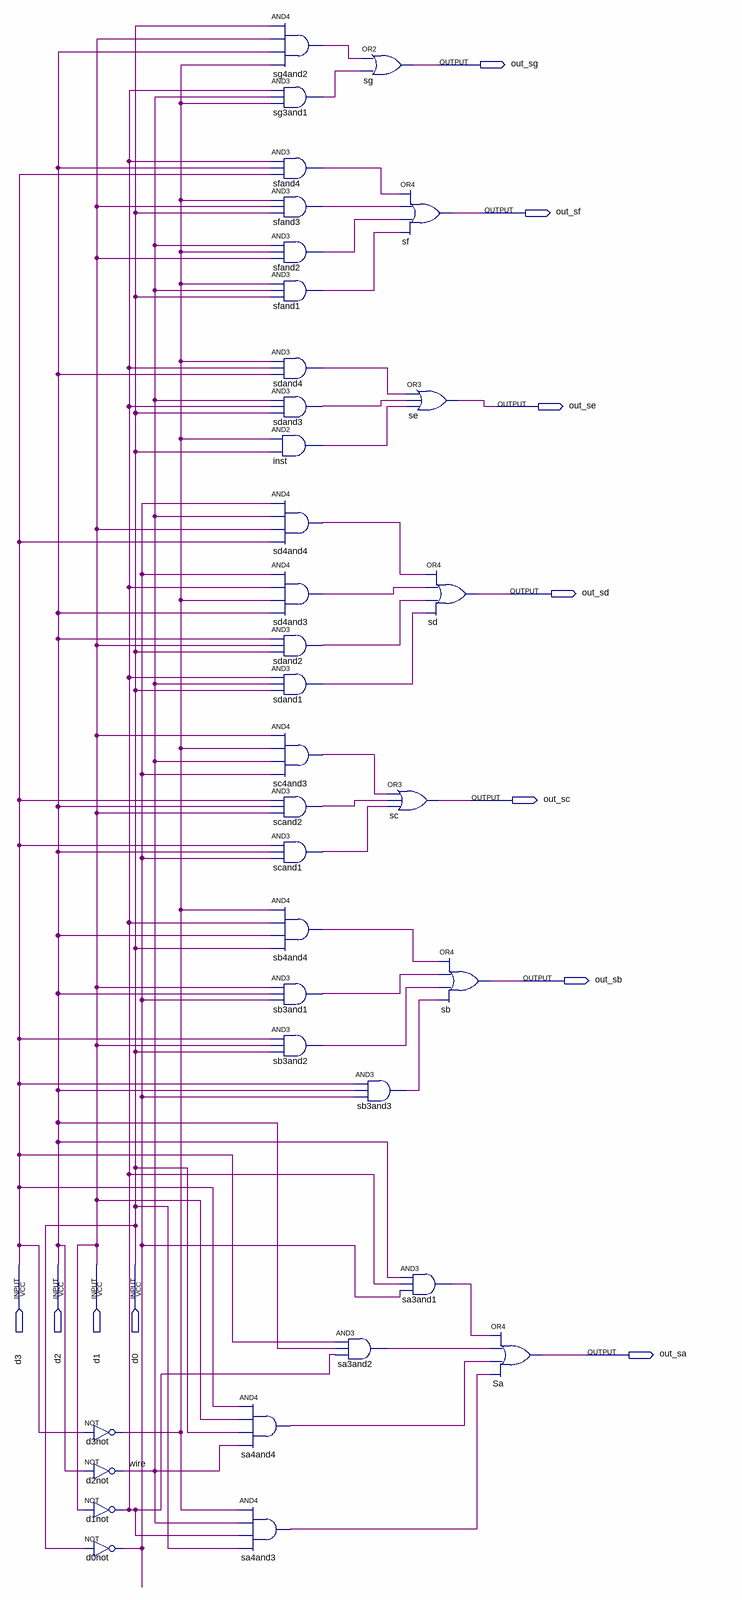
[diagram p0: schematic sheet]
// Quartus schematic lab2.bdf as structural Verilog: 35 symbols, 11 pins
module lab2 (
  input  d3,
  input  d2,
  input  d1,
  input  d0,
  output out_sg,
  output out_sf,
  output out_se,
  output out_sd,
  output out_sc,
  output out_sb,
  output out_sa
);

  wire d0not_out, d1not_out, d3not_out, inst_out, sa3and1_out, sa3and2_out, sa4and3_out, sa4and4_out,
       sb3and1_out, sb3and2_out, sb3and3_out, sb4and4_out, sc4and3_out, scand1_out, scand2_out, sd4and3_out,
       sd4and4_out, sdand1_out, sdand2_out, sdand3_out, sdand4_out, sfand1_out, sfand2_out, sfand3_out,
       sfand4_out, sg3and1_out, sg4and2_out, \wire ;

  not d3not (d3not_out, d3);
  not d2not (\wire , d2);
  not d1not (d1not_out, d1);
  not d0not (d0not_out, d0);
  and sg4and2 (sg4and2_out, d0, d1, d2, d3not_out);
  and sg3and1 (sg3and1_out, d1not_out, \wire , d3not_out);
  and sfand4 (sfand4_out, d1not_out, d2, d3);
  and sfand3 (sfand3_out, d3not_out, d1, d0);
  and sfand2 (sfand2_out, \wire , d3not_out, d1);
  and sfand1 (sfand1_out, d3not_out, \wire , d0);
  and sdand4 (sdand4_out, d3not_out, d1not_out, d2);
  and sdand3 (sdand3_out, \wire , d1not_out, d0);
  and inst (inst_out, d3not_out, d0);
  and sd4and4 (sd4and4_out, d0not_out, \wire , d1, d3);
  and sd4and3 (sd4and3_out, d0not_out, d1not_out, d3not_out, d2);
  and sdand2 (sdand2_out, d2, d1, d0);
  and sdand1 (sdand1_out, d1not_out, \wire , d0);
  and sc4and3 (sc4and3_out, d1, d3not_out, \wire , d0not_out);
  and scand2 (scand2_out, d3, d2, d1);
  and scand1 (scand1_out, d3, d2, d0not_out);
  and sb4and4 (sb4and4_out, d3not_out, d1not_out, d2, d0);
  and sb3and1 (sb3and1_out, d1, d2, d0not_out);
  and sb3and2 (sb3and2_out, d3, d1, d0);
  and sa4and4 (sa4and4_out, d3, d1, d0, \wire );
  and sa4and3 (sa4and3_out, d3not_out, \wire , d1not_out, d0);
  or sg (out_sg, sg4and2_out, sg3and1_out);
  and sb3and3 (sb3and3_out, d3, d2, d0not_out);
  and sa3and2 (sa3and2_out, d3, d2, d1not_out);
  or sf (out_sf, sfand4_out, sfand3_out, sfand2_out, sfand1_out);
  or se (out_se, sdand4_out, sdand3_out, inst_out);
  or sd (out_sd, sd4and4_out, sd4and3_out, sdand2_out, sdand1_out);
  or sc (out_sc, sc4and3_out, scand2_out, scand1_out);
  and sa3and1 (sa3and1_out, d2, d1not_out, d0not_out);
  or sb (out_sb, sb4and4_out, sb3and1_out, sb3and2_out, sb3and3_out);
  or Sa (out_sa, sa3and1_out, sa3and2_out, sa4and4_out, sa4and3_out);
endmodule
